# EAGLE design CS-N-2PIN (EAGLE 6.4)
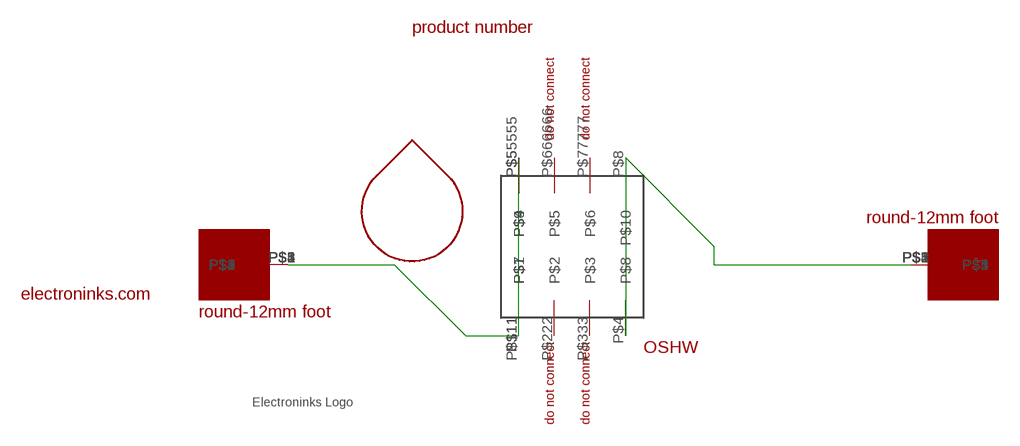
[diagram p0: schematic, sheet 1]

## Parts
U$1  ROUND-12MM-FOOT-1.8MM  [ROUND-12MM-FOOT]
U$2  ROUND-12MM-FOOT-1.8MM  [ROUND-12MM-FOOT]
U$3  DROPLET_LOGO_3MM  [DROPLET_LOGO_3MM]
U$4  OSHW_3MM  [OSHW_3MM]
U$5  ELECTRONINKS_COM_15MM  [ELECTRONINKS_COM_15MM]
U$6  ELECTRONINKS_LOGO_10MM  [ELECTRONINKS_LOGO_10MM]
U$7  C_N_2PIN  [CS_N_2PIN]
U$8  966206-2000-AR-PR-SOCKET-2-PIN-6POS  [966206-2000-AR-PR-6-POS-THROUGH-HOLE]

## Nets
N$3: U$2.P$1 U$8.P$5 U$8.P$11 U$8.P$111 U$8.P$55555
N$4: U$1.P$1 U$8.P$4 U$8.P$8
Unconnected: U$1.P$2 U$1.P$3 U$1.P$4 U$1.P$5 U$2.P$2 U$2.P$3 U$2.P$4 U$2.P$5 U$8.P$222 U$8.P$333 U$8.P$77777 U$8.P$666666

## Library data of the parts
U$1 U$2 = electroninks:ROUND-12MM-FOOT-1.8MM
U$3 = electroninks:DROPLET_LOGO_3MM
U$4 = electroninks:OSHW_3MM
U$5 = electroninks:ELECTRONINKS_COM_15MM
U$6 = electroninks:ELECTRONINKS_LOGO_10MM
U$7 = electroninks:C_N_2PIN
U$8 = electroninks:966206-2000-AR-PR-SOCKET-2-PIN-6POS

## Board
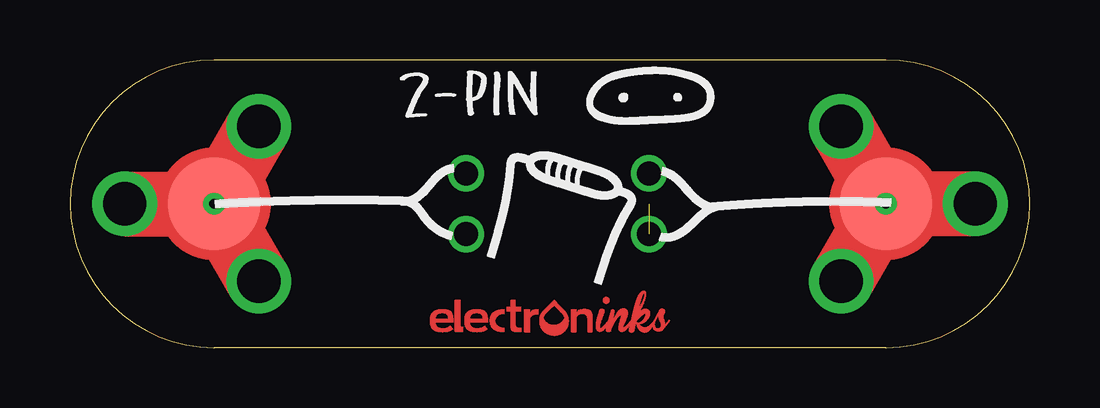
[diagram p1: board, top side]
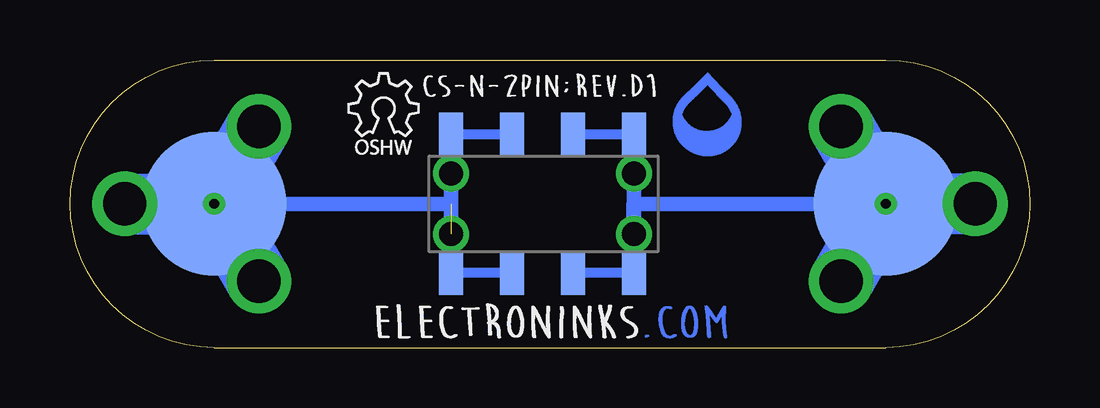
[diagram p2: board, bottom side, seen from below]

Size 40 x 12 mm. Coordinates in mm from the lower left corner, seen from the top.
Outline: 34,0 arc180 34,12 6,12 arc180 6,0 34,0
Copper layers (1*16): Top 0.035mm / dielectric 1.5mm / Bottom 0.035mm
Design rules "default": minimum track width 10mil, minimum drill 24mil, track to track 8mil, track to pad 8mil, pad to pad 8mil, via to via 8mil, smd to smd 8mil, copper to edge 40mil, drill to drill 8mil, minimum pad ring 10mil, minimum via ring 8mil, stop-mask expansion 4mil, vias tented up to drill 0mil, thermal gap 10mil

### Footprints (pad centres in the part's own frame; a part is rotated, then mirrored left to right if it is on the bottom)
ROUND-12MM-FOOT = drill 1.8: P$1 -3.726,0; P$2 1.863,3.227; P$3 1.863,-3.227 | smd 3.85 x 3.85: P$4 0,0 | smd 6 x 6 bottom: P$5 0,0 | drill 0.4: P$6 0,0
966206-2000-AR-PR-6-POS-THROUGH-HOLE = drill 1: P$4 7.62,-1.27; P$5 0,1.27; P$8 7.62,1.27; P$11 0,-1.27 | smd 1 x 1.82: P$111 0,-2.89; P$222 2.54,-2.89; P$333 5.08,-2.89; P$4444 7.62,-2.89; P$8888 7.62,2.89; P$55555 0,2.89; P$77777 5.08,2.89; P$666666 2.54,2.89

### Placement (x,y rotation side)
U$1  34,6 180 top
U$2  6,6 0 top
U$3  13.44,9.09 0 bottom
U$4  28.43,7.84 0 bottom
U$5  27.5,0 0 bottom
U$6  15,0.5 0 top
U$7  25.4,10.2 0 bottom
U$8  16.5,6 180 bottom

### Tracks (layer width: path | path; a pad name or v marks a point on that pad's centre or on a via)
N$1
  Bottom 0.406: 16.51,8.89 19.05,8.89
N$2
  Bottom 0.406: 16.56,3.12 19.06,3.12
N$3
  Bottom 0.406: U$8.P$11 U$8.P$111 | U$8.P$5 U$8.P$55555
  Bottom 0.61: U$8.P$11 U$8.P$5 | U$8.P$111 16.5,3.81 16.51,3.81 16.51,6 6,6
N$4  (1 unrouted)
  Bottom 0.406: 21.59,8.89 24.13,8.89
  Bottom 0.61: U$8.P$4 24.12,2.54 24.13,2.54 24.13,6 | 24.13,8.89 24.13,6 | 24.13,6 34,6
N$5
  Bottom 0.406: 21.56,3.12 24.06,3.12